# Altium schematic sheet FPGA 2.SCHDOC: FPGA Rack
size 420 x 297 mm; DrawnBy: zas; Revision: V1.0; SheetNumber: 6; SheetTotal: 25; DocumentName: FPGA 2.SCHDOC
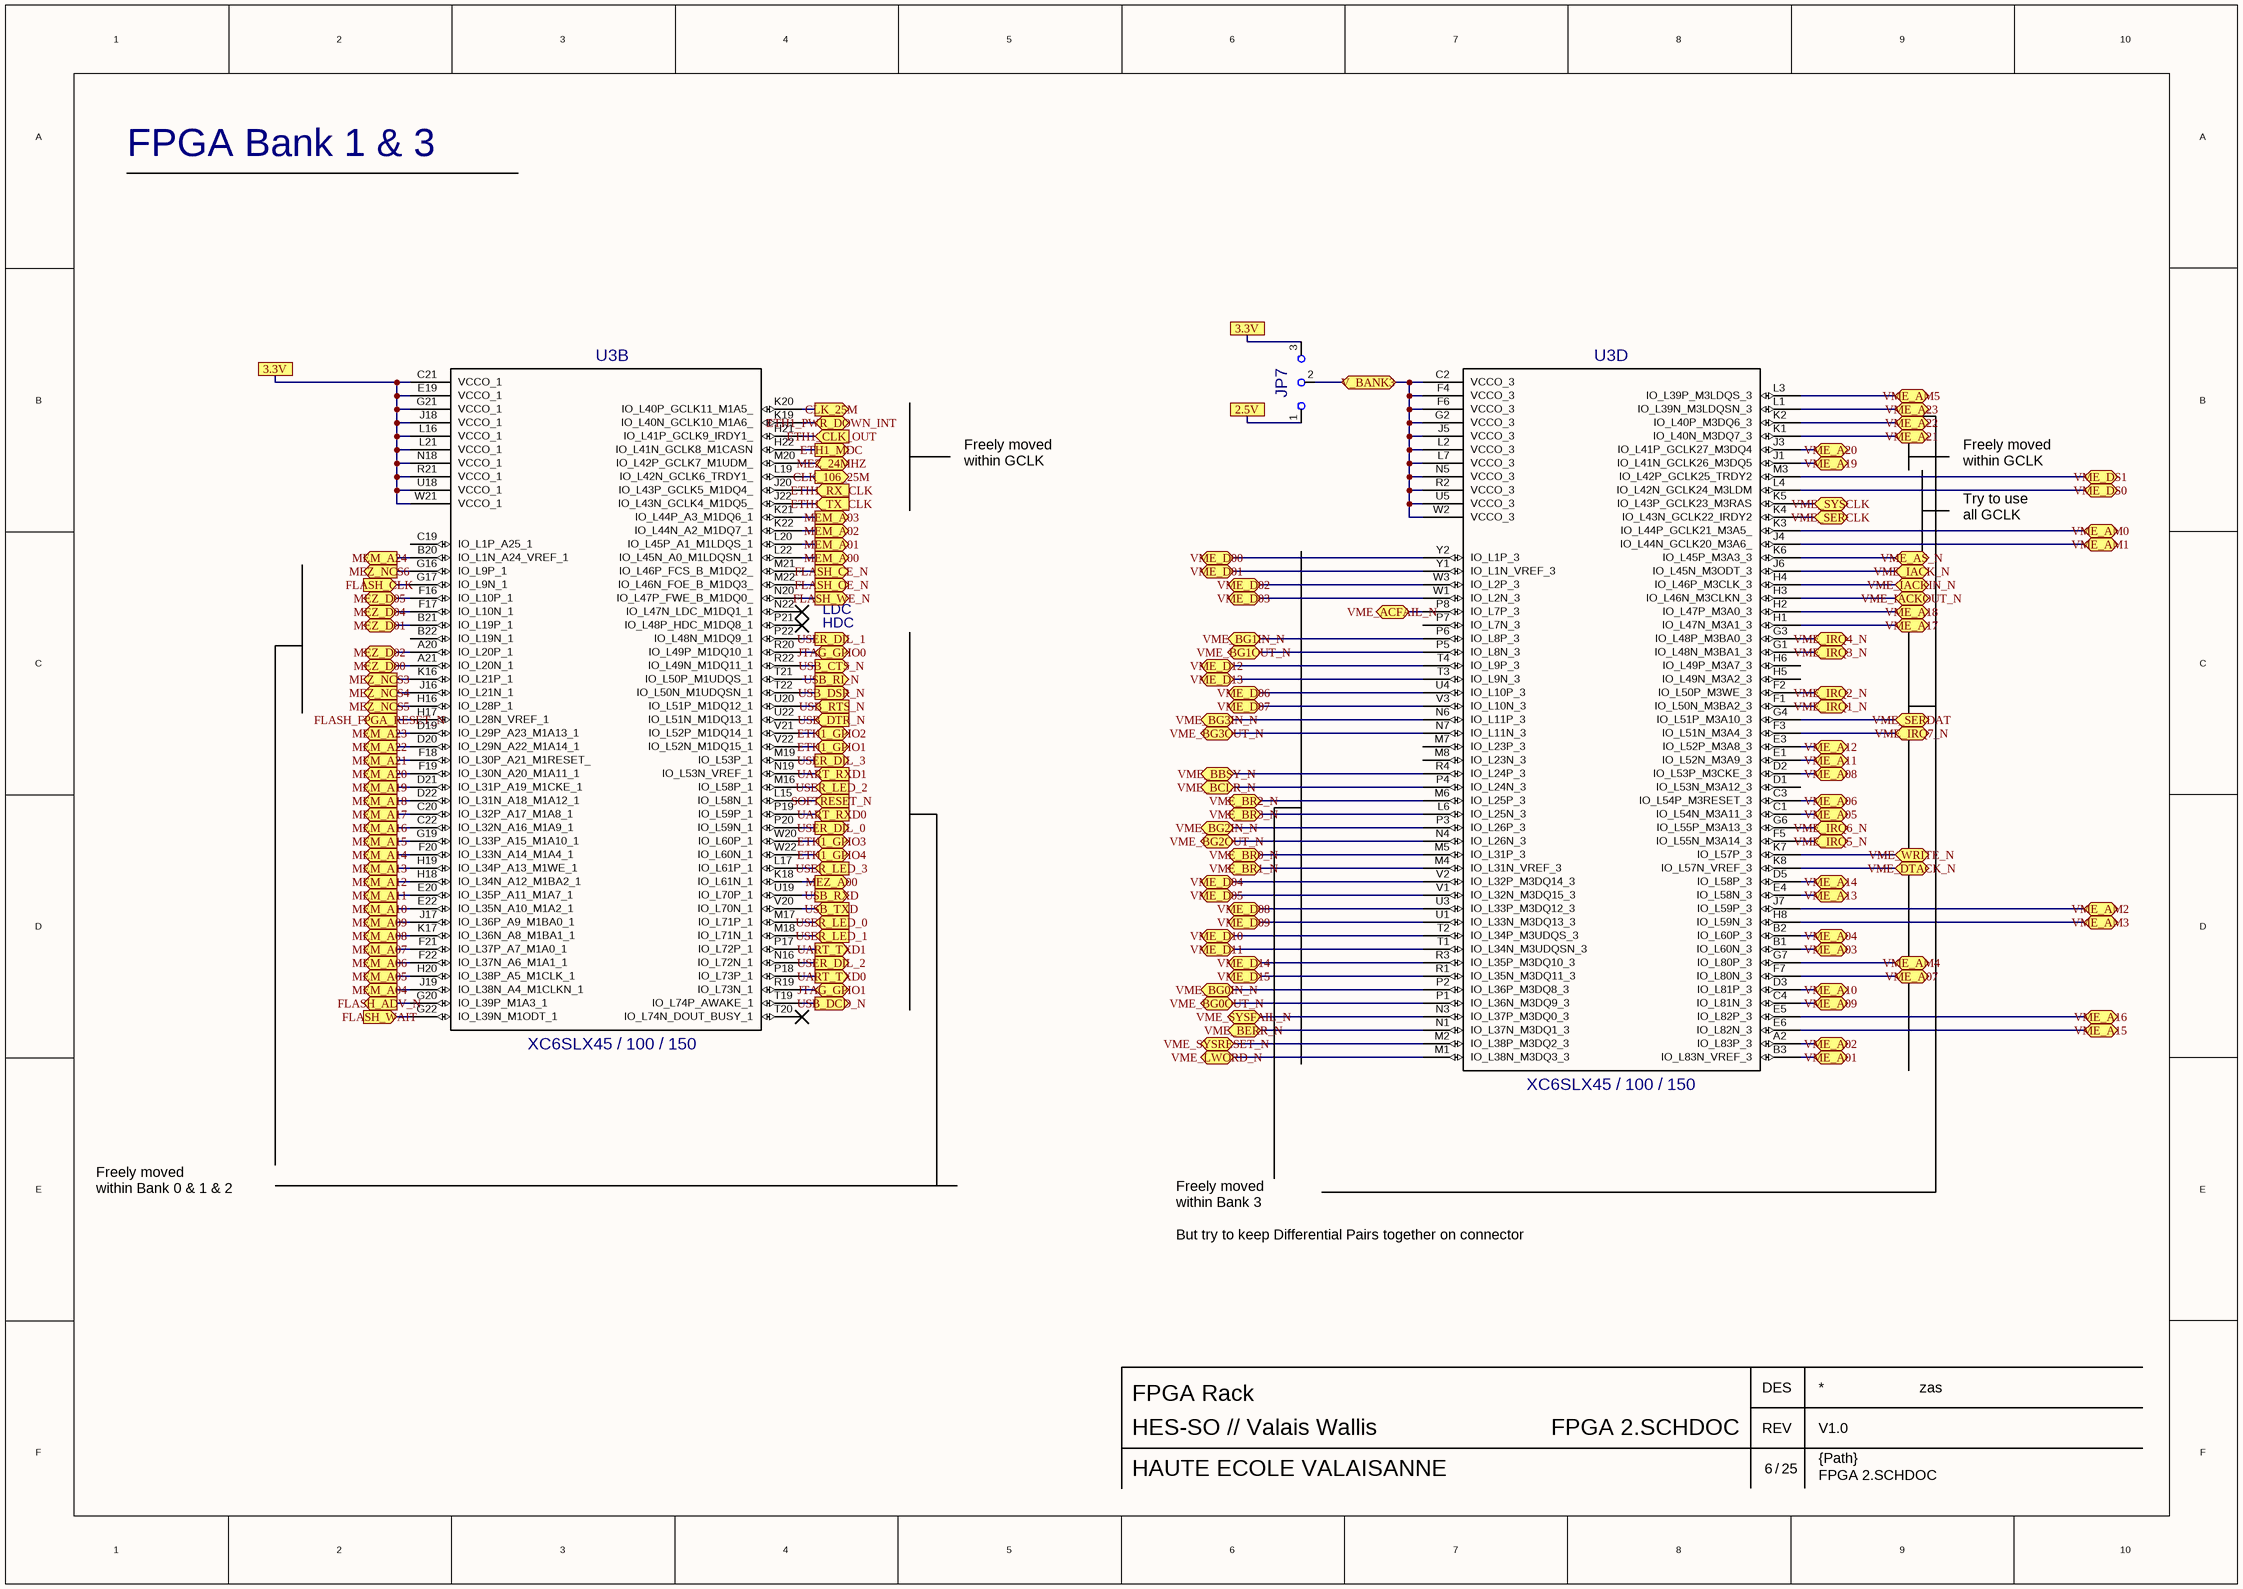
[diagram p0: FPGA 2.SCHDOC]

## Parts
JP7  JUMPER-SMD3  [JUMPER-SMD3]  (value not drawn)
U3  value XC6SLX45 / 100 / 150  [BGA23X23-FG484]  (hidden comment: XC6SLX150 FGG484)  (parts B,D of 5)

## Ports
2.5V, 3.3V, CLK_25M (out), CLK_106_25M (out), ETH1_CLK_OUT (in), ETH1_GPIO1 (bidir), ETH1_GPIO2 (bidir), ETH1_GPIO3 (bidir), ETH1_GPIO4 (bidir), ETH1_MDC (out), ETH1_PWR_DOWN_INT (bidir), ETH1_RX_CLK (in), ETH1_TX_CLK (in), FLASH_ADV_N (out), FLASH_CE_N (out), FLASH_CLK (in), FLASH_FPGA_RESET_N (out), FLASH_OE_N (out), FLASH_WAIT (in), FLASH_WE_N (out), JTAG_GPIO0 (bidir), JTAG_GPIO1 (bidir), MEM_A00 (out), MEM_A01 (out), MEM_A02 (out), MEM_A03 (out), MEM_A04 (out), MEM_A05 (out), MEM_A06 (out), MEM_A07 (out), MEM_A08 (out), MEM_A09 (out), MEM_A10 (out), MEM_A11 (out), MEM_A12 (out), MEM_A13 (out), MEM_A14 (out), MEM_A15 (out), MEM_A16 (out), MEM_A17 (out), MEM_A18 (out), MEM_A19 (out), MEM_A20 (out), MEM_A21 (out), MEM_A22 (out), MEM_A23 (out), MEM_A24 (out), MEZ_24MHZ (bidir), MEZ_A00 (out), MEZ_D00 (bidir), MEZ_D01 (bidir), MEZ_D02 (bidir), MEZ_D04 (bidir), MEZ_D05 (bidir), MEZ_NCS3 (out), MEZ_NCS4 (out), MEZ_NCS5 (out), MEZ_NCS6 (out), SOFTRESET_N (in), UART_RXD0 (in), UART_RXD1 (in), UART_TXD0 (out), UART_TXD1 (out), USB_CTS_N (out), USB_DCD_N (out), USB_DSR_N (out), USB_DTR_N (in), USB_RI_N (out), USB_RTS_N (in), USB_RXD (out), USB_TXD (in), USER_DIL_0 (out), USER_DIL_1 (out), USER_DIL_2 (out), USER_DIL_3 (out), USER_LED_0 (in), USER_LED_1 (in), USER_LED_2 (in), USER_LED_3 (in), V_BANK3 (bidir), VME_A01 (bidir), VME_A02 (bidir), VME_A03 (bidir), VME_A04 (bidir), VME_A05 (bidir), VME_A06 (bidir), VME_A07 (bidir), VME_A08 (bidir), VME_A09 (bidir), VME_A10 (bidir), VME_A11 (bidir), VME_A12 (bidir), VME_A13 (bidir), VME_A14 (bidir), VME_A15 (bidir), VME_A16 (bidir), VME_A17 (bidir), VME_A18 (bidir), VME_A19 (bidir), VME_A20 (bidir), VME_A21 (bidir), VME_A22 (bidir), VME_A23 (bidir), VME_ACFAIL_N (bidir), VME_AM0 (bidir), VME_AM1 (bidir), VME_AM2 (bidir), VME_AM3 (bidir), VME_AM4 (bidir), VME_AM5 (bidir), VME_AS_N (bidir), VME_BBSY_N (bidir), VME_BCLR_N (bidir), VME_BERR_N (bidir), VME_BG0IN_N (bidir), VME_BG0OUT_N (bidir), VME_BG1IN_N (bidir), VME_BG1OUT_N (bidir), VME_BG2IN_N (bidir), VME_BG2OUT_N (bidir), VME_BG3IN_N (bidir), VME_BG3OUT_N (bidir), VME_BR0_N (bidir), VME_BR1_N (bidir), VME_BR2_N (bidir), VME_BR3_N (bidir), VME_D00 (bidir), VME_D01 (bidir), VME_D02 (bidir), VME_D03 (bidir), VME_D04 (bidir), VME_D05 (bidir), VME_D06 (bidir), VME_D07 (bidir), VME_D08 (bidir), VME_D09 (bidir), VME_D10 (bidir), VME_D11 (bidir), VME_D12 (bidir), VME_D13 (bidir), VME_D14 (bidir), VME_D15 (bidir), VME_DS0 (bidir), VME_DS1 (bidir), VME_DTACK_N (bidir), VME_IACK_N (bidir), VME_IACKIN_N (bidir), VME_IACKOUT_N (bidir), VME_IRQ1_N (bidir), VME_IRQ2_N (bidir), VME_IRQ3_N (bidir), VME_IRQ4_N (bidir), VME_IRQ5_N (bidir), VME_IRQ6_N (bidir), VME_IRQ7_N (bidir), VME_LWORD_N (bidir), VME_SERCLK (bidir), VME_SERDAT (bidir), VME_SYSCLK (bidir), VME_SYSFAIL_N (bidir), VME_SYSRESET_N (bidir), VME_WRITE_N (bidir)

## Nets
CLK_25M: U3.K20(IO_L40P_GCLK11_M1A5_) ; port CLK_25M
CLK_106_25M: U3.L19(IO_L42N_GCLK6_TRDY1_) ; port CLK_106_25M
ETH1_CLK_OUT: U3.H21(IO_L41P_GCLK9_IRDY1_) ; port ETH1_CLK_OUT
ETH1_GPIO1: U3.V22(IO_L52N_M1DQ15_1) ; port ETH1_GPIO1
ETH1_GPIO2: U3.V21(IO_L52P_M1DQ14_1) ; port ETH1_GPIO2
ETH1_GPIO3: U3.W20(IO_L60P_1) ; port ETH1_GPIO3
ETH1_GPIO4: U3.W22(IO_L60N_1) ; port ETH1_GPIO4
ETH1_MDC: U3.H22(IO_L41N_GCLK8_M1CASN) ; port ETH1_MDC
ETH1_PWR_DOWN_INT: U3.K19(IO_L40N_GCLK10_M1A6_) ; port ETH1_PWR_DOWN_INT
ETH1_RX_CLK: U3.J20(IO_L43P_GCLK5_M1DQ4_) ; port ETH1_RX_CLK
ETH1_TX_CLK: U3.J22(IO_L43N_GCLK4_M1DQ5_) ; port ETH1_TX_CLK
FLASH_ADV_N: U3.G20(IO_L39P_M1A3_1) ; port FLASH_ADV_N
FLASH_CE_N: U3.M21(IO_L46P_FCS_B_M1DQ2_) ; port FLASH_CE_N
FLASH_CLK: U3.G17(IO_L9N_1) ; port FLASH_CLK
FLASH_FPGA_RESET_N: U3.H17(IO_L28N_VREF_1) ; port FLASH_FPGA_RESET_N
FLASH_OE_N: U3.M22(IO_L46N_FOE_B_M1DQ3_) ; port FLASH_OE_N
FLASH_WAIT: U3.G22(IO_L39N_M1ODT_1) ; port FLASH_WAIT
FLASH_WE_N: U3.N20(IO_L47P_FWE_B_M1DQ0_) ; port FLASH_WE_N
JTAG_GPIO0: U3.R20(IO_L49P_M1DQ10_1) ; port JTAG_GPIO0
JTAG_GPIO1: U3.R19(IO_L73N_1) ; port JTAG_GPIO1
MEM_A00: U3.L22(IO_L45N_A0_M1LDQSN_1) ; port MEM_A00
MEM_A01: U3.L20(IO_L45P_A1_M1LDQS_1) ; port MEM_A01
MEM_A02: U3.K22(IO_L44N_A2_M1DQ7_1) ; port MEM_A02
MEM_A03: U3.K21(IO_L44P_A3_M1DQ6_1) ; port MEM_A03
MEM_A04: U3.J19(IO_L38N_A4_M1CLKN_1) ; port MEM_A04
MEM_A05: U3.H20(IO_L38P_A5_M1CLK_1) ; port MEM_A05
MEM_A06: U3.F22(IO_L37N_A6_M1A1_1) ; port MEM_A06
MEM_A07: U3.F21(IO_L37P_A7_M1A0_1) ; port MEM_A07
MEM_A08: U3.K17(IO_L36N_A8_M1BA1_1) ; port MEM_A08
MEM_A09: U3.J17(IO_L36P_A9_M1BA0_1) ; port MEM_A09
MEM_A10: U3.E22(IO_L35N_A10_M1A2_1) ; port MEM_A10
MEM_A11: U3.E20(IO_L35P_A11_M1A7_1) ; port MEM_A11
MEM_A12: U3.H18(IO_L34N_A12_M1BA2_1) ; port MEM_A12
MEM_A13: U3.H19(IO_L34P_A13_M1WE_1) ; port MEM_A13
MEM_A14: U3.F20(IO_L33N_A14_M1A4_1) ; port MEM_A14
MEM_A15: U3.G19(IO_L33P_A15_M1A10_1) ; port MEM_A15
MEM_A16: U3.C22(IO_L32N_A16_M1A9_1) ; port MEM_A16
MEM_A17: U3.C20(IO_L32P_A17_M1A8_1) ; port MEM_A17
MEM_A18: U3.D22(IO_L31N_A18_M1A12_1) ; port MEM_A18
MEM_A19: U3.D21(IO_L31P_A19_M1CKE_1) ; port MEM_A19
MEM_A20: U3.F19(IO_L30N_A20_M1A11_1) ; port MEM_A20
MEM_A21: U3.F18(IO_L30P_A21_M1RESET_) ; port MEM_A21
MEM_A22: U3.D20(IO_L29N_A22_M1A14_1) ; port MEM_A22
MEM_A23: U3.D19(IO_L29P_A23_M1A13_1) ; port MEM_A23
MEM_A24: U3.B20(IO_L1N_A24_VREF_1) ; port MEM_A24
MEZ_24MHZ: U3.M20(IO_L42P_GCLK7_M1UDM_) ; port MEZ_24MHZ
MEZ_A00: U3.K18(IO_L61N_1) ; port MEZ_A00
MEZ_D00: U3.A21(IO_L20N_1) ; port MEZ_D00
MEZ_D01: U3.B21(IO_L19P_1) ; port MEZ_D01
MEZ_D02: U3.A20(IO_L20P_1) ; port MEZ_D02
MEZ_D04: U3.F17(IO_L10N_1) ; port MEZ_D04
MEZ_D05: U3.F16(IO_L10P_1) ; port MEZ_D05
MEZ_NCS3: U3.K16(IO_L21P_1) ; port MEZ_NCS3
MEZ_NCS4: U3.J16(IO_L21N_1) ; port MEZ_NCS4
MEZ_NCS5: U3.H16(IO_L28P_1) ; port MEZ_NCS5
MEZ_NCS6: U3.G16(IO_L9P_1) ; port MEZ_NCS6
SOFTRESET_N: U3.L15(IO_L58N_1) ; port SOFTRESET_N
UART_RXD0: U3.P19(IO_L59P_1) ; port UART_RXD0
UART_RXD1: U3.N19(IO_L53N_VREF_1) ; port UART_RXD1
UART_TXD0: U3.P18(IO_L73P_1) ; port UART_TXD0
UART_TXD1: U3.P17(IO_L72P_1) ; port UART_TXD1
USB_CTS_N: U3.R22(IO_L49N_M1DQ11_1) ; port USB_CTS_N
USB_DCD_N: U3.T19(IO_L74P_AWAKE_1) ; port USB_DCD_N
USB_DSR_N: U3.T22(IO_L50N_M1UDQSN_1) ; port USB_DSR_N
USB_DTR_N: U3.U22(IO_L51N_M1DQ13_1) ; port USB_DTR_N
USB_RI_N: U3.T21(IO_L50P_M1UDQS_1) ; port USB_RI_N
USB_RTS_N: U3.U20(IO_L51P_M1DQ12_1) ; port USB_RTS_N
USB_RXD: U3.U19(IO_L70P_1) ; port USB_RXD
USB_TXD: U3.V20(IO_L70N_1) ; port USB_TXD
USER_DIL_0: U3.P20(IO_L59N_1) ; port USER_DIL_0
USER_DIL_1: U3.P22(IO_L48N_M1DQ9_1) ; port USER_DIL_1
USER_DIL_2: U3.N16(IO_L72N_1) ; port USER_DIL_2
USER_DIL_3: U3.M19(IO_L53P_1) ; port USER_DIL_3
USER_LED_0: U3.M17(IO_L71P_1) ; port USER_LED_0
USER_LED_1: U3.M18(IO_L71N_1) ; port USER_LED_1
USER_LED_2: U3.M16(IO_L58P_1) ; port USER_LED_2
USER_LED_3: U3.L17(IO_L61P_1) ; port USER_LED_3
V_BANK3: JP7.2 U3.C2(VCCO_3) U3.F4(VCCO_3) U3.F6(VCCO_3) U3.G2(VCCO_3) U3.J5(VCCO_3) U3.L2(VCCO_3) U3.L7(VCCO_3) U3.N5(VCCO_3) U3.R2(VCCO_3) U3.U5(VCCO_3) U3.W2(VCCO_3) ; port V_BANK3
VME_A01: U3.B3(IO_L83N_VREF_3) ; port VME_A01
VME_A02: U3.A2(IO_L83P_3) ; port VME_A02
VME_A03: U3.B1(IO_L60N_3) ; port VME_A03
VME_A04: U3.B2(IO_L60P_3) ; port VME_A04
VME_A05: U3.C1(IO_L54N_M3A11_3) ; port VME_A05
VME_A06: U3.C3(IO_L54P_M3RESET_3) ; port VME_A06
VME_A07: U3.F7(IO_L80N_3) ; port VME_A07
VME_A08: U3.D2(IO_L53P_M3CKE_3) ; port VME_A08
VME_A09: U3.C4(IO_L81N_3) ; port VME_A09
VME_A10: U3.D3(IO_L81P_3) ; port VME_A10
VME_A11: U3.E1(IO_L52N_M3A9_3) ; port VME_A11
VME_A12: U3.E3(IO_L52P_M3A8_3) ; port VME_A12
VME_A13: U3.E4(IO_L58N_3) ; port VME_A13
VME_A14: U3.D5(IO_L58P_3) ; port VME_A14
VME_A15: U3.E6(IO_L82N_3) ; port VME_A15
VME_A16: U3.E5(IO_L82P_3) ; port VME_A16
VME_A17: U3.H1(IO_L47N_M3A1_3) ; port VME_A17
VME_A18: U3.H2(IO_L47P_M3A0_3) ; port VME_A18
VME_A19: U3.J1(IO_L41N_GCLK26_M3DQ5) ; port VME_A19
VME_A20: U3.J3(IO_L41P_GCLK27_M3DQ4) ; port VME_A20
VME_A21: U3.K1(IO_L40N_M3DQ7_3) ; port VME_A21
VME_A22: U3.K2(IO_L40P_M3DQ6_3) ; port VME_A22
VME_A23: U3.L1(IO_L39N_M3LDQSN_3) ; port VME_A23
VME_ACFAIL_N: U3.P8(IO_L7P_3) ; port VME_ACFAIL_N
VME_AM0: U3.K3(IO_L44P_GCLK21_M3A5_) ; port VME_AM0
VME_AM1: U3.J4(IO_L44N_GCLK20_M3A6_) ; port VME_AM1
VME_AM2: U3.J7(IO_L59P_3) ; port VME_AM2
VME_AM3: U3.H8(IO_L59N_3) ; port VME_AM3
VME_AM4: U3.G7(IO_L80P_3) ; port VME_AM4
VME_AM5: U3.L3(IO_L39P_M3LDQS_3) ; port VME_AM5
VME_AS_N: U3.K6(IO_L45P_M3A3_3) ; port VME_AS_N
VME_BBSY_N: U3.R4(IO_L24P_3) ; port VME_BBSY_N
VME_BCLR_N: U3.P4(IO_L24N_3) ; port VME_BCLR_N
VME_BERR_N: U3.N1(IO_L37N_M3DQ1_3) ; port VME_BERR_N
VME_BG0IN_N: U3.P2(IO_L36P_M3DQ8_3) ; port VME_BG0IN_N
VME_BG0OUT_N: U3.P1(IO_L36N_M3DQ9_3) ; port VME_BG0OUT_N
VME_BG1IN_N: U3.P6(IO_L8P_3) ; port VME_BG1IN_N
VME_BG1OUT_N: U3.P5(IO_L8N_3) ; port VME_BG1OUT_N
VME_BG2IN_N: U3.P3(IO_L26P_3) ; port VME_BG2IN_N
VME_BG2OUT_N: U3.N4(IO_L26N_3) ; port VME_BG2OUT_N
VME_BG3IN_N: U3.N6(IO_L11P_3) ; port VME_BG3IN_N
VME_BG3OUT_N: U3.N7(IO_L11N_3) ; port VME_BG3OUT_N
VME_BR0_N: U3.M5(IO_L31P_3) ; port VME_BR0_N
VME_BR1_N: U3.M4(IO_L31N_VREF_3) ; port VME_BR1_N
VME_BR2_N: U3.M6(IO_L25P_3) ; port VME_BR2_N
VME_BR3_N: U3.L6(IO_L25N_3) ; port VME_BR3_N
VME_D00: U3.Y2(IO_L1P_3) ; port VME_D00
VME_D01: U3.Y1(IO_L1N_VREF_3) ; port VME_D01
VME_D02: U3.W3(IO_L2P_3) ; port VME_D02
VME_D03: U3.W1(IO_L2N_3) ; port VME_D03
VME_D04: U3.V2(IO_L32P_M3DQ14_3) ; port VME_D04
VME_D05: U3.V1(IO_L32N_M3DQ15_3) ; port VME_D05
VME_D06: U3.U4(IO_L10P_3) ; port VME_D06
VME_D07: U3.V3(IO_L10N_3) ; port VME_D07
VME_D08: U3.U3(IO_L33P_M3DQ12_3) ; port VME_D08
VME_D09: U3.U1(IO_L33N_M3DQ13_3) ; port VME_D09
VME_D10: U3.T2(IO_L34P_M3UDQS_3) ; port VME_D10
VME_D11: U3.T1(IO_L34N_M3UDQSN_3) ; port VME_D11
VME_D12: U3.T4(IO_L9P_3) ; port VME_D12
VME_D13: U3.T3(IO_L9N_3) ; port VME_D13
VME_D14: U3.R3(IO_L35P_M3DQ10_3) ; port VME_D14
VME_D15: U3.R1(IO_L35N_M3DQ11_3) ; port VME_D15
VME_DS0: U3.L4(IO_L42N_GCLK24_M3LDM) ; port VME_DS0
VME_DS1: U3.M3(IO_L42P_GCLK25_TRDY2) ; port VME_DS1
VME_DTACK_N: U3.K8(IO_L57N_VREF_3) ; port VME_DTACK_N
VME_IACK_N: U3.J6(IO_L45N_M3ODT_3) ; port VME_IACK_N
VME_IACKIN_N: U3.H4(IO_L46P_M3CLK_3) ; port VME_IACKIN_N
VME_IACKOUT_N: U3.H3(IO_L46N_M3CLKN_3) ; port VME_IACKOUT_N
VME_IRQ1_N: U3.F1(IO_L50N_M3BA2_3) ; port VME_IRQ1_N
VME_IRQ2_N: U3.F2(IO_L50P_M3WE_3) ; port VME_IRQ2_N
VME_IRQ3_N: U3.G1(IO_L48N_M3BA1_3) ; port VME_IRQ3_N
VME_IRQ4_N: U3.G3(IO_L48P_M3BA0_3) ; port VME_IRQ4_N
VME_IRQ5_N: U3.F5(IO_L55N_M3A14_3) ; port VME_IRQ5_N
VME_IRQ6_N: U3.G6(IO_L55P_M3A13_3) ; port VME_IRQ6_N
VME_IRQ7_N: U3.F3(IO_L51N_M3A4_3) ; port VME_IRQ7_N
VME_LWORD_N: U3.M1(IO_L38N_M3DQ3_3) ; port VME_LWORD_N
VME_SERCLK: U3.K4(IO_L43N_GCLK22_IRDY2) ; port VME_SERCLK
VME_SERDAT: U3.G4(IO_L51P_M3A10_3) ; port VME_SERDAT
VME_SYSCLK: U3.K5(IO_L43P_GCLK23_M3RAS) ; port VME_SYSCLK
VME_SYSFAIL_N: U3.N3(IO_L37P_M3DQ0_3) ; port VME_SYSFAIL_N
VME_SYSRESET_N: U3.M2(IO_L38P_M3DQ2_3) ; port VME_SYSRESET_N
VME_WRITE_N: U3.K7(IO_L57P_3) ; port VME_WRITE_N
NetU3_C21: U3.C21(VCCO_1) U3.E19(VCCO_1) U3.G21(VCCO_1) U3.J18(VCCO_1) U3.L16(VCCO_1) U3.L21(VCCO_1) U3.N18(VCCO_1) U3.R21(VCCO_1) U3.U18(VCCO_1) U3.W21(VCCO_1)

Not connected (* = marked no-connect by the designer): JP7 1 3; U3 B22(IO_L19N_1) C19(IO_L1P_A25_1) D1(IO_L53N_M3A12_3) H5(IO_L49N_M3A2_3) H6(IO_L49P_M3A7_3) M7(IO_L23P_3) M8(IO_L23N_3) N22(IO_L47N_LDC_M1DQ1_1) P7(IO_L7N_3) P21(IO_L48P_HDC_M1DQ8_1) T20(IO_L74N_DOUT_BUSY_1)

## Notes on the sheet
- FPGA Bank 1 & 3
- Freely moved
  within GCLK
- Try to use
  all GCLK
- HDC
- LDC
- Freely moved
  within Bank 0 & 1 & 2
- Freely moved
  within Bank 3
  But try to keep Differential Pairs together on connector
- DES
- HES-SO // Valais Wallis
- HAUTE ECOLE VALAISANNE
- /
- REV
- {Path}

## Library data of the parts
JP7 = JUMPER-SMD3: Value: Voltage_Bank_0